# EAGLE design FTDI_RS232 (EAGLE 6.4)
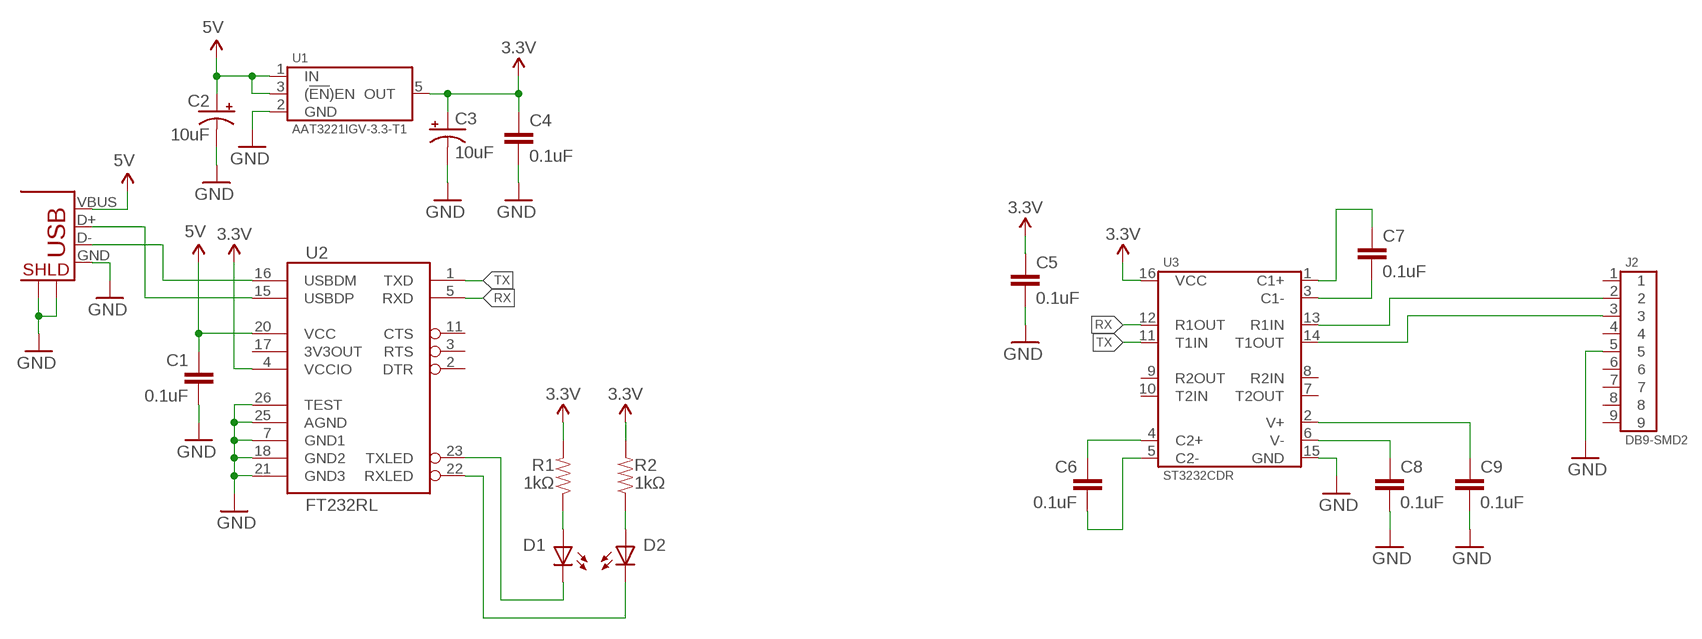
[diagram p0: schematic, sheet 1]

## Parts
C1  0.1uF  CAP0805  [0805]
C2  10uF  CAP_POL0805  [0805-CAP_POL]
C3  10uF  CAP_POL0805  [0805-CAP_POL]
C4  0.1uF  CAP0805  [0805]
C5  0.1uF  CAP0805  [0805]
C6  0.1uF  CAP0805  [0805]
C7  0.1uF  CAP0805  [0805]
C8  0.1uF  CAP0805  [0805]
C9  0.1uF  CAP0805  [0805]
D1  LED-0805  [0805-LED]
D2  LED-0805  [0805-LED]
J1  USB+SHIELD  [USB-B-PTH]
J2  DB9-SMD2  [DB9_SMD2]
R1  1kΩ  RESISTOR-0805  [0805-RES]
R2  1kΩ  RESISTOR-0805  [0805-RES]
U1  AAT3221IGV-3.3-T1  [SOT23-5]
U2  FT232RL  FT232RL-BASICSSOP  [SSOP28DB]
U3  ST3232CDR  [SOIC-16]

## Nets
3.3V: C3.A(+) C4.1 C5.1 R1.2 R2.2 U1.5(OUT) U2.4(VCCIO) U3.16(VCC)
5V: C1.1 C2.A(+) J1.VBUS U1.1(IN) U1.3((!EN!)EN) U2.20(VCC)
D_N: J1.D- U2.16(USBDM)
D_P: J1.D+ U2.15(USBDP)
GND: C1.2 C2.C(-) C3.C(-) C4.2 C5.2 C8.2 C9.2 J1.GND J1.S1 J1.S2 J2.5 U1.2(GND) U2.7(GND1) U2.18(GND2) U2.21(GND3) U2.25(AGND) U2.26(TEST) U3.15(GND)
N$4: C6.1 U3.4(C2+)
N$5: C6.2 U3.5(C2-)
N$6: D2.A R2.1
N$7: D1.A R1.1
N$8: D1.C U2.23(TXLED)
N$9: D2.C U2.22(RXLED)
N$16: C8.1 U3.6(V-)
N$17: C9.1 U3.2(V+)
N$23: J2.2 U3.13(R1IN)
N$24: C7.2 U3.3(C1-)
N$25: C7.1 U3.1(C1+)
N$26: J2.3 U3.14(T1OUT)
RX: U2.5(RXD) U3.12(R1OUT)
TX: U2.1(TXD) U3.11(T1IN)
Unconnected: J2.1 J2.4 J2.6 J2.7 J2.8 J2.9 U2.2(DTR) U2.3(RTS) U2.11(CTS) U2.17(3V3OUT) U3.7(T2OUT) U3.8(R2IN) U3.9(R2OUT) U3.10(T2IN)

## Library data of the parts
C1 C4-C9 = SparkFun-Passives:CAP: Capacitor Standard 0603 ceramic capacitor, and 0.1" leaded capacitor.
C2 C3 = SparkFun-Passives:CAP_POL: Capacitor Polarized These are standard SMD and PTH capacitors. Normally 10uF, 47uF, and 100uF in electrolytic and tantalum varieties. Always verify the external diameter of the through hole cap, it varies with capacity, voltage, and manufacturer. The EIA devices should be standard.
D1 D2 = Passives:LED
J1 = SparkFun-Connectors:USB+SHIELD: USB+Shield USB connector with shield pins connectable
J2 = Connectors:DB9
R1 R2 = Passives:RESISTOR
U1 = Skyworks:AAT3221: 150mA 3.3v LDO Regulator
U2 = SparkFun-DigitalIC:FT232RL-BASIC: USB UART This is the simplified version of the FT232RL unit. Only what you need, nothing you don't. Spark Fun Electronics SKU : COM-00650
U3 = STMicroelectrionics:ST3232

## Board
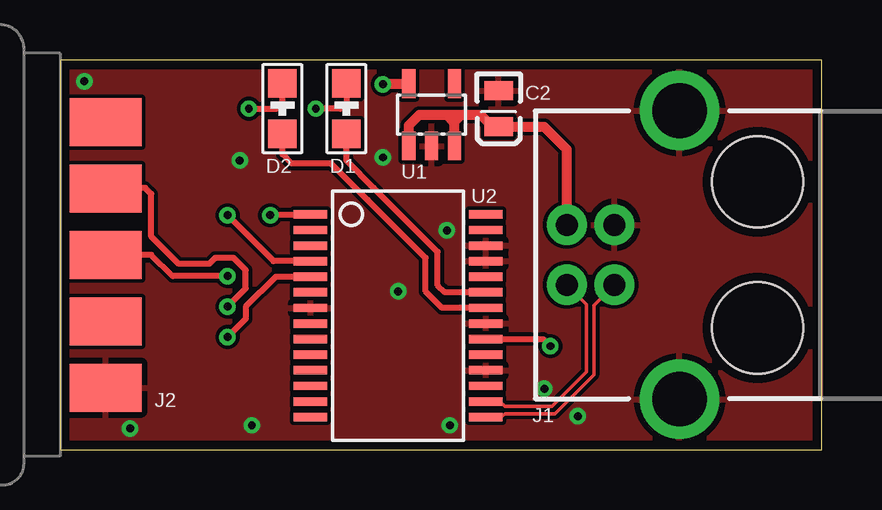
[diagram p1: board, top side]
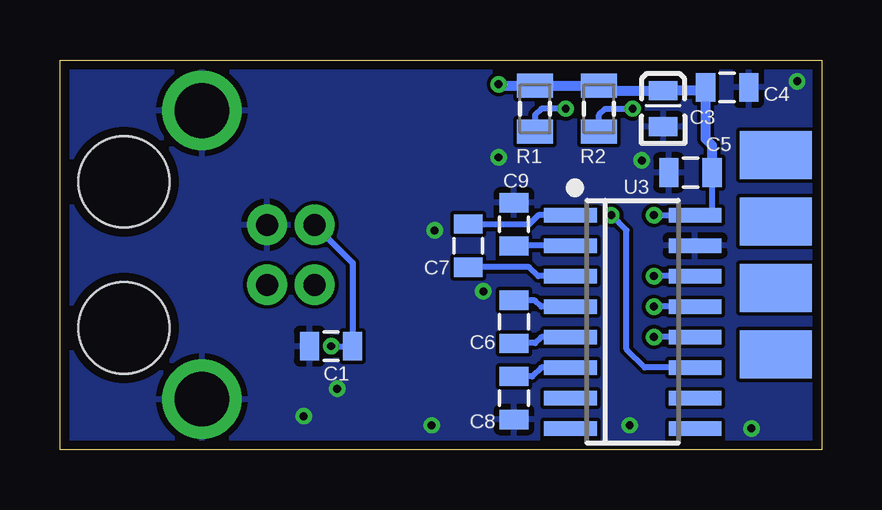
[diagram p2: board, bottom side, seen from below]

Size 31.75 x 16.26 mm. Coordinates in mm from the lower left corner, seen from the top.
Outline: 0,0 31.75,0 31.75,16.26 0,16.26 0,0
Copper layers (1*16): Top 0.0356mm / dielectric 1.5011mm / Bottom 0.0356mm
Design rules "oshpark-2layer *": minimum track width 6mil, minimum drill 13mil, track to track 6mil, track to pad 6mil, pad to pad 6mil, via to via 6mil, smd to smd 6mil, copper to edge 15mil, drill to drill 6mil, minimum pad ring 7mil, minimum via ring 7mil, stop-mask expansion 4mil, vias tented up to drill 20mil, thermal gap 10mil
Holes 3.81 mm at 29.08,11.18 29.08,5.08

### Footprints (pad centres in the part's own frame; a part is rotated, then mirrored left to right if it is on the bottom)
0805 = smd 0.8 x 1.2: 1 -0.9,0; 2 0.9,0
0805-CAP_POL = smd 0.8 x 1.2: A 0.75,0; C -0.75,0
0805-LED = smd 1.2 x 1.2: A -1.05,0; C 1.05,0
USB-B-PTH = drill 0.914 pad 1.676: D+ 0,1.25; D- 1.981,1.25; GND 0,-1.25; VBUS 1.981,-1.25 | drill 2.286: S1 -2.718,-6.02; S2 -2.718,6.02
DB9_SMD2 = smd 2 x 3: 1 -5.54,0; 2 -2.77,0; 3 0,0; 4 2.77,0; 5 5.54,0 | smd 2 x 3 bottom: 6 -4.155,0; 7 -1.385,0; 8 1.385,0; 9 4.155,0
0805-RES = smd 1 x 1.5: 1 -0.95,0; 2 0.95,0
SOT23-5 = smd 1.2 x 0.55: 1 1.3,-0.95; 2 1.3,0; 3 1.3,0.95; 4 -1.3,0.95; 5 -1.3,-0.95
SSOP28DB = smd 0.348 x 1.397: 1 -4.225,-3.656; 2 -3.575,-3.656; 3 -2.925,-3.656; 4 -2.275,-3.656; 5 -1.625,-3.656; 6 -0.975,-3.656; 7 -0.325,-3.656; 8 0.325,-3.656; 9 0.975,-3.656; 10 1.625,-3.656; 11 2.275,-3.656; 12 2.925,-3.656; 13 3.575,-3.656; 14 4.225,-3.656; 15 4.225,3.656; 16 3.575,3.656; 17 2.925,3.656; 18 2.275,3.656; 19 1.625,3.656; 20 0.975,3.656; 21 0.325,3.656; 22 -0.325,3.656; 23 -0.975,3.656; 24 -1.625,3.656; 25 -2.275,3.656; 26 -2.925,3.656; 27 -3.575,3.656; 28 -4.225,3.656
SOIC-16 = smd 2.2 x 0.6: 1 -2.6,4.445; 2 -2.6,3.175; 3 -2.6,1.905; 4 -2.6,0.635; 5 -2.6,-0.635; 6 -2.6,-1.905; 7 -2.6,-3.175; 8 -2.6,-4.445; 9 2.6,-4.445; 10 2.6,-3.175; 11 2.6,-1.905; 12 2.6,-0.635; 13 2.6,0.635; 14 2.6,1.905; 15 2.6,3.175; 16 2.6,4.445

### Placement (x,y rotation side)
C1  20.45,4.32 180 bottom
C2  18.29,14.22 270 top
C3  6.6,14.22 90 bottom
C4  3.94,15.11 0 bottom
C5  5.46,11.56 180 bottom
C6  12.83,5.33 270 bottom
C7  14.73,8.51 270 bottom
C8  12.83,2.16 270 bottom
C9  12.83,9.4 90 bottom
D1  11.94,14.22 270 top
D2  9.27,14.22 270 top
J1  23.11,8.13 180 top
J2  1.91,8.13 270 top
R1  11.94,14.22 90 bottom
R2  9.27,14.22 90 bottom
U1  15.49,13.97 270 top
U2  14.1,5.59 270 top
U3  7.87,5.33 0 bottom

### Tracks (layer width: path | path; a pad name or v marks a point on that pad's centre or on a via)
3.3V  (via drill 0.33)
  Top 0.254: U2.4 8.9,7.86 v6.99,9.78
  Top 0.406: U1.5 14.54,15.24 v13.46,15.24
  Bottom 0.254: C5.1 4.56,9.78 U3.16 v6.99,9.78
  Bottom 0.406: 13.46,15.1 v13.46,15.24 13.46,15.17 R1.2 R2.2 9.07,14.97 C3.A 6.58,15 4.95,15 C4.1 4.84,12.96 4.57,12.7 4.57,11.57 C5.1
5V  (via drill 0.33)
  Top 0.254: U2.20 20.15,4.61 v20.45,4.32
  Top 0.406: J1.VBUS 21.13,12.52 20.19,13.46 C2.A 18.02,13.47 17.53,13.97 16.74,13.97 | U1.1 14.54,13.53 14.99,13.97 16.13,13.97 | 16.13,13.97 16.44,13.97 | 16.44,13.97 16.74,13.97 | U1.3 16.44,13.97 | 16.13,13.97 16.43,13.66 16.74,13.97
  Bottom 0.254: v20.45,4.32 C1.1 19.55,7.79 J1.VBUS
D_N
  Top 0.152: J1.D- 21.95,6.07 21.95,3.24 20.51,1.8 18.54,1.8 18.33,2.01 U2.16
D_P
  Top 0.152: J1.D+ 22.25,6.01 22.25,3.11 20.64,1.5 18.54,1.5 18.41,1.36 U2.15
GND  (via drill 0.33)
  other vias: 20.19,2.54 21.59,1.4 16.26,1.02 8,1.02 2.92,0.89 1.02,15.37 7.49,12.06 13.46,12.19 16.13,9.14 14.1,6.6
  pour Bottom: -1.27,17.53 33.02,17.53 33.02,-1.27 -1.27,-1.27
  pour Top: -0.64,16.89 32.38,16.89 32.38,-0.64 -0.64,-0.64
N$4
  Bottom 0.254: U3.4 11.68,5.97 11.94,6.22 12.82,6.22 C6.1
N$5
  Bottom 0.254: U3.5 11.68,4.7 11.94,4.45 12.82,4.45 C6.2
N$6  (via drill 0.33)
  Top 0.254: v7.87,14.22 9.02,14.22 9.27,14.48 D2.A
  Bottom 0.254: R2.1 9.27,13.97 9.02,14.22 v7.87,14.22
N$7  (via drill 0.33)
  Top 0.254: D1.A 11.94,14.48 11.68,14.22 v10.67,14.22
  Bottom 0.254: v10.67,14.22 11.68,14.22 11.94,13.97 R1.1
N$8
  Top 0.254: U2.23 16.04,6.56 15.75,6.86 15.75,8.26 13.08,10.92 11.94,12.06 D1.C
N$9
  Top 0.254: U2.22 15.93,5.91 15.24,6.6 15.24,8 12.83,10.41 11.3,11.94 9.65,11.94 9.27,12.32 D2.C
N$16
  Bottom 0.254: U3.6 11.68,3.43 12.06,3.05 12.82,3.05 C8.1
N$17
  Bottom 0.254: U3.2 12.82,8.51 C9.1
N$23  (via drill 0.33)
  Top 0.254: J2.2 1.93,10.92 3.56,10.92 3.81,10.67 3.81,8.89 4.95,7.75 6.22,7.75 6.48,8 7.24,8 7.75,7.49 7.75,6.73 v6.99,5.97
  Bottom 0.254: U3.13 v6.99,5.97
N$24
  Bottom 0.254: U3.3 11.81,7.24 12.19,7.62 C7.2
N$25
  Bottom 0.254: U3.1 11.81,9.78 12.19,9.4 14.72,9.4 C7.1
N$26  (via drill 0.33)
  Top 0.254: J2.3 3.81,8.13 4.7,7.24 v6.99,7.24
  Bottom 0.254: U3.14 v6.99,7.24
RX  (via drill 0.33)
  Top 0.254: U2.5 8.99,7.21 7.75,5.97 7.75,5.46 v6.99,4.7
  Bottom 0.254: U3.12 v6.99,4.7
TX  (via drill 0.33)
  Top 0.254: v8.76,9.78 8.8,9.81 U2.1
  Bottom 0.254: U3.11 7.37,3.43 8.13,4.19 8.13,9.14 v8.76,9.78